# EAGLE design Sequencer-V01-010-eagle7 (EAGLE 7.7.0)
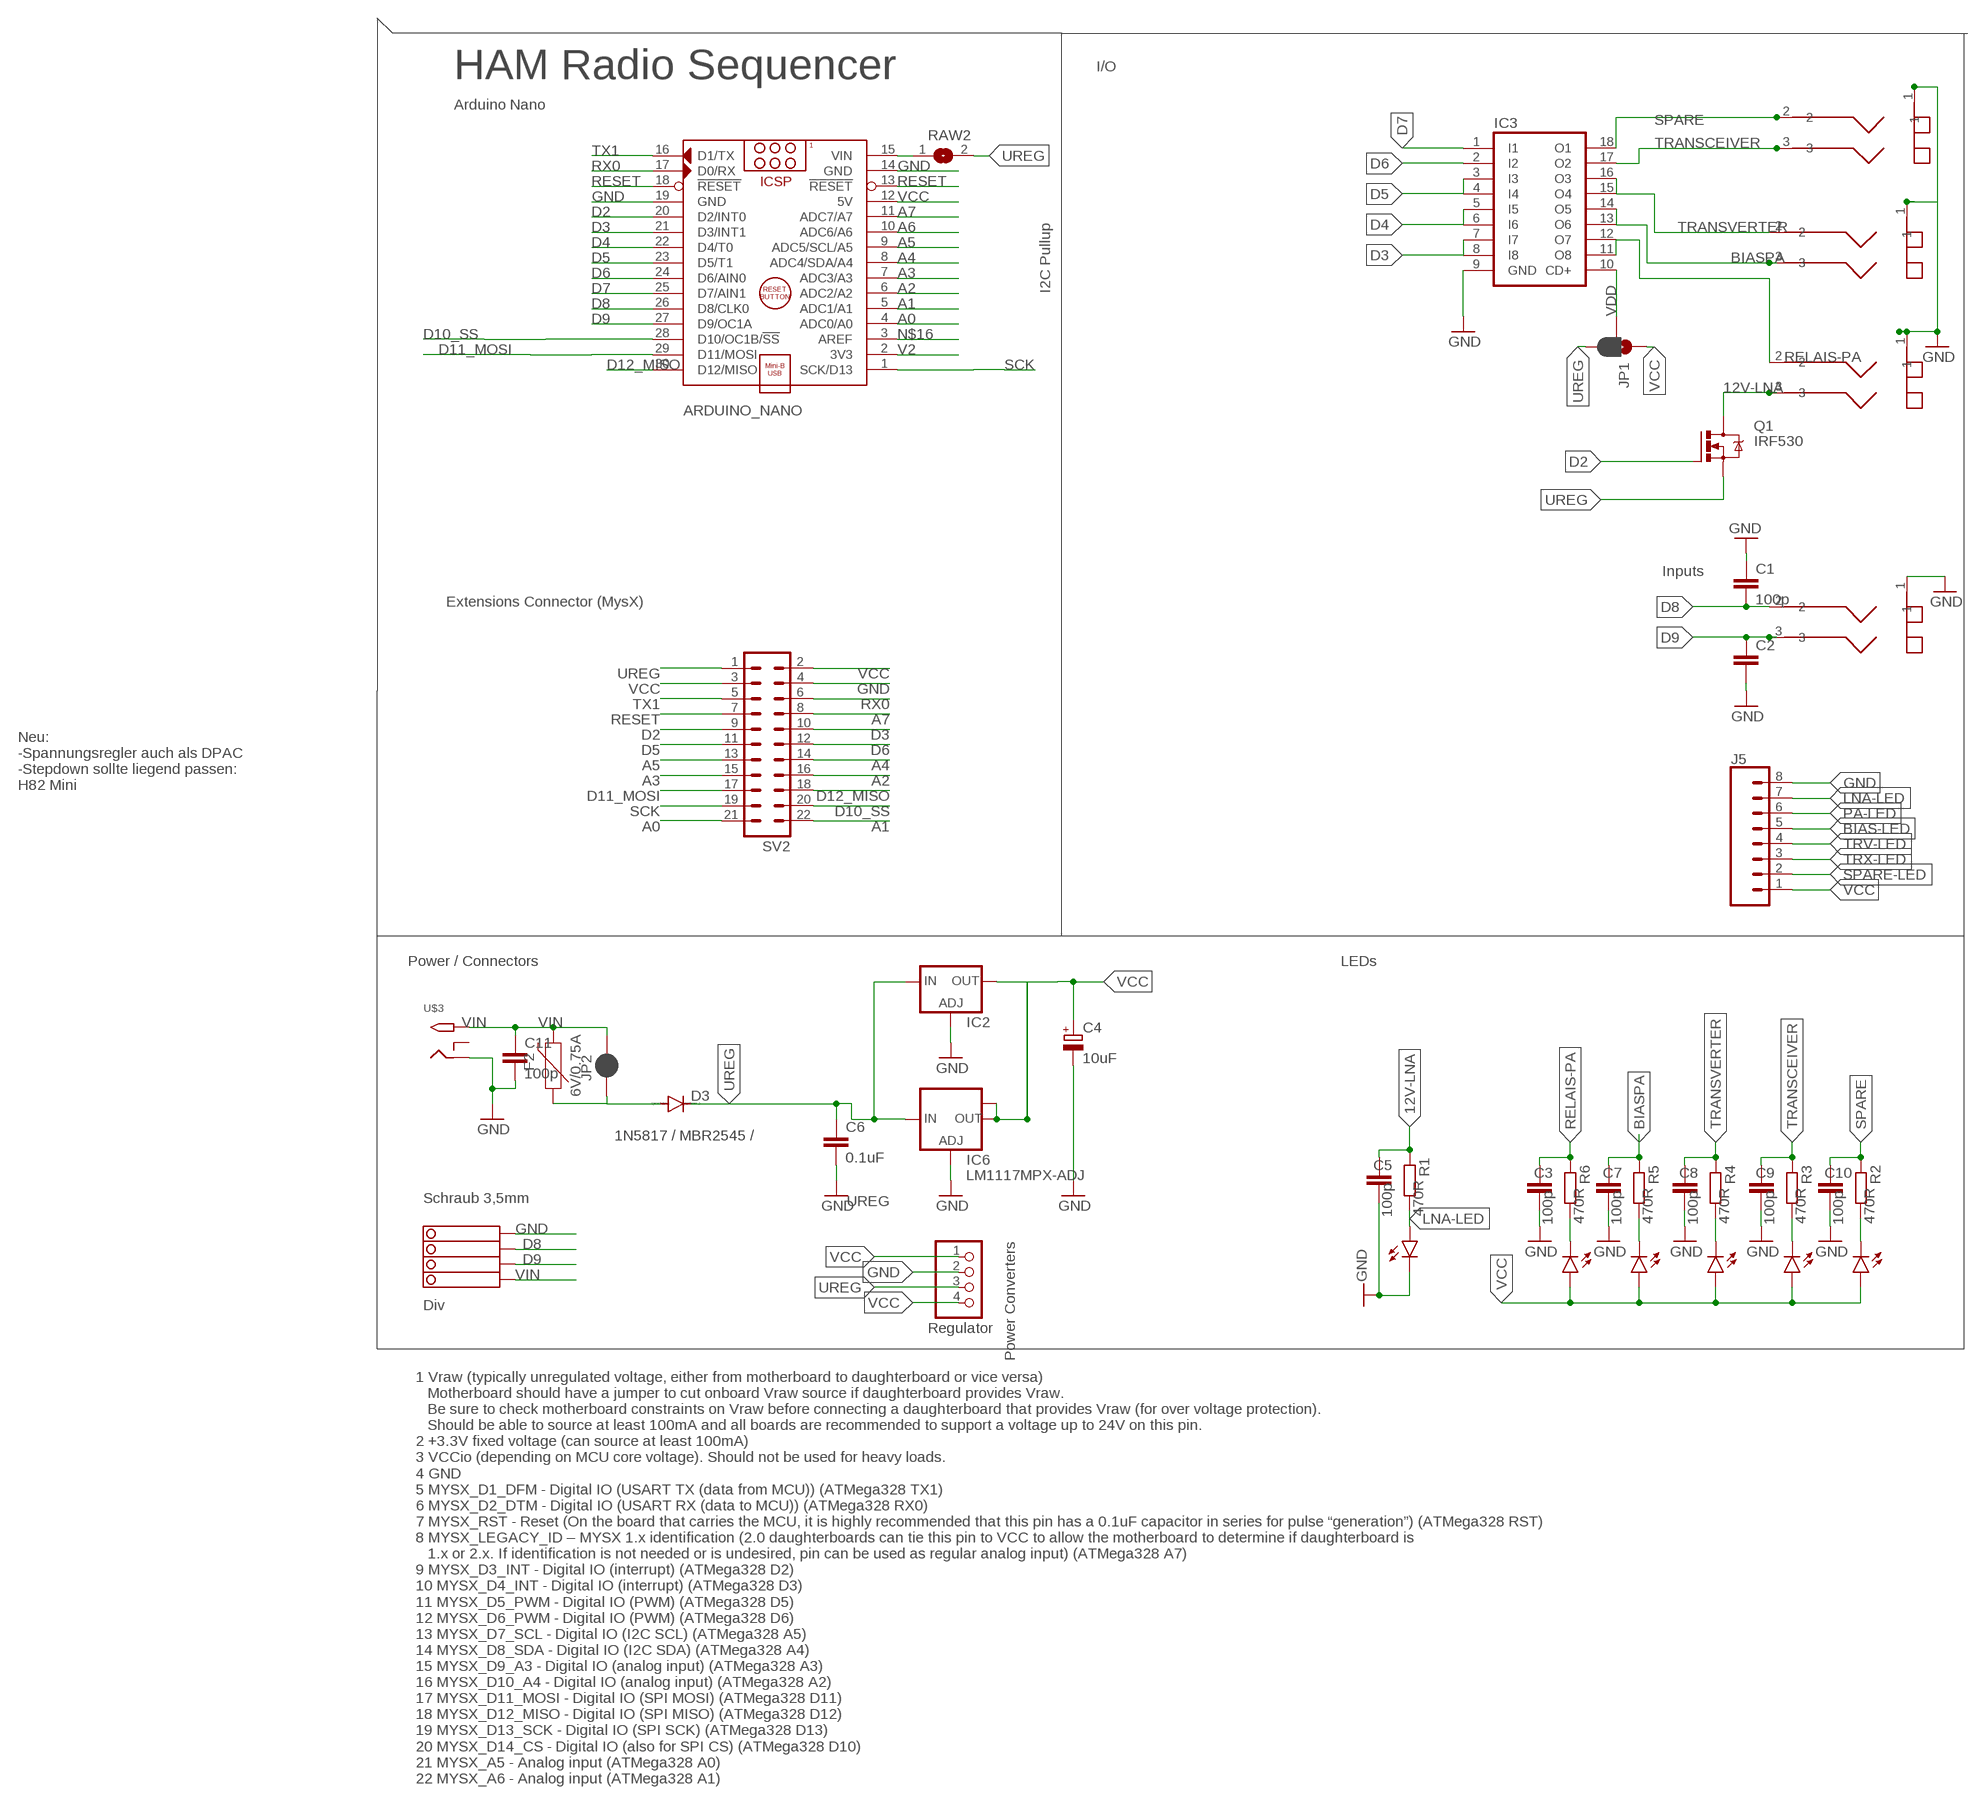
[diagram p0: schematic, sheet 1]

## Parts
ARDUINO_NANO  ARDUINO_NANO_OHNE-BOHR  [ARDUINO_NANO]
C1  100p  C-EU025-025X050  [C025-025X050]
C2  C-EU025-025X050  [C025-025X050]
C3  100p  C-EU025-025X050  [C025-025X050]
C4  10uF  CPOL-EUE3.5-8  [E3,5-8]
C5  100p  C-EU025-025X050  [C025-025X050]
C6  0.1uF  C-EU050-024X044  [C050-024X044]
C7  100p  C-EU025-025X050  [C025-025X050]
C8  100p  C-EU025-025X050  [C025-025X050]
C9  100p  C-EU025-025X050  [C025-025X050]
C10  100p  C-EU025-025X050  [C025-025X050]
C11  100p  C-EU025-025X050  [C025-025X050]
D3  1N5817 / MBR2545 /  DIODE-D-2.5  [D-2.5]
F2  6V/0.75A  PPTC_THREE-QUARTER-AMP  [1206]
IC2  LD117ADT50TR  [DPACK]
IC3  ULN2803A  [DIL18]
IC6  LM1117MPX-ADJ  [SOT223]
J1  RCJ-2234  [RCJ-2221]
J2  RCJ-2234  [RCJ-2221]
J3  RCJ-2234  [RCJ-2221]
J4  RCJ-2234  [RCJ-2221]
J5  CONN_08LOCK  [1X08_LOCK]
JP1  JUMPER-SMT_3_1-NC_PASTE_NO-SILK  [SMT-JUMPER_3_1-NC_PASTE_NO-SILK]
JP2  JUMPER-SMT_2_NC_PASTE_NO-SILK  [SMT-JUMPER_2_NC_PASTE_NO-SILK]
LED1  LED3MM  [LED3MM]
LED2  LED3MM  [LED3MM]
LED3  LED3MM  [LED3MM]
LED4  LED3MM  [LED3MM]
LED5  LED3MM  [LED3MM]
LED6  LED3MM  [LED3MM]
Q1  IRF530  [TO220BV]
R1  470R  R-EU_0204/5  [0204/5]
R2  470R  R-EU_0204/5  [0204/5]
R3  470R  R-EU_0204/5  [0204/5]
R4  470R  R-EU_0204/5  [0204/5]
R5  470R  R-EU_0204/5  [0204/5]
R6  470R  R-EU_0204/5  [0204/5]
RAW2  SJ  [SJ]
STEPDWN  PINHD-1X04_2.54-S  [1X04-S]
SV2  MA11-2  [MA11-2]
U$3  2.1MMJACKTHM  [PJ-102A]
X4  1751264  [1751264]

## Nets
12V-LNA: C5.1 J3.3 Q1.D R1.1
A0 [Signal]: ARDUINO_NANO.4(ADC0/A0) SV2.21
A1 [Signal]: ARDUINO_NANO.5(ADC1/A1) SV2.22
A2 [Signal]: ARDUINO_NANO.6(ADC2/A2) SV2.16
A3 [Signal]: ARDUINO_NANO.7(ADC3/A3) SV2.15
A4 [Signal]: ARDUINO_NANO.8(ADC4/SDA/A4) SV2.14
A5 [Signal]: ARDUINO_NANO.9(ADC5/SCL/A5) SV2.13
A6 [Signal]: ARDUINO_NANO.10(ADC6/A6)
A7 [Signal]: ARDUINO_NANO.11(ADC7/A7) SV2.8
BIAS-LED [Signal]: J5.5 LED5.K(C) R5.2
BIASPA: C7.1 IC3.13(O6) IC3.14(O5) J2.3 R5.1
D2 [Signal]: ARDUINO_NANO.20(D2/INT0) Q1.G SV2.9
D3 [Signal]: ARDUINO_NANO.21(D3/INT1) IC3.7(I7) IC3.8(I8) SV2.10
D4 [Signal]: ARDUINO_NANO.22(D4/T0) IC3.5(I5) IC3.6(I6)
D5 [Signal]: ARDUINO_NANO.23(D5/T1) IC3.3(I3) IC3.4(I4) SV2.11
D6 [Signal]: ARDUINO_NANO.24(D6/AIN0) IC3.2(I2) SV2.12
D7 [Signal]: ARDUINO_NANO.25(D7/AIN1) IC3.1(I1)
D8 [Signal]: ARDUINO_NANO.26(D8/CLK0) C1.2 J4.2 X4.3
D9 [Signal]: ARDUINO_NANO.27(D9/OC1A) C2.1 J4.3 X4.2
D10_SS [Signal]: ARDUINO_NANO.28(D10/OC1B/!SS) SV2.20
D11_MOSI [Signal]: ARDUINO_NANO.29(D11/MOSI) SV2.17
D12_MISO [Signal]: ARDUINO_NANO.30(D12/MISO) SV2.18
GND [Power]: ARDUINO_NANO.14(GND) ARDUINO_NANO.19(GND) C1.1 C2.2 C3.2 C4.- C5.2 C6.2 C7.2 C8.2 C9.2 C10.2 C11.2 IC2.1(ADJ) IC3.9(GND) IC6.1(ADJ) J1.1 J2.1 J3.1 J4.1 J5.8 LED1.K(C) STEPDWN.2 SV2.4 U$3.RING X4.4
LNA-LED [Signal]: J5.7 LED1.A R1.2
N$1: D3.A F2.1 JP2.1
N$16: ARDUINO_NANO.3(AREF)
PA-LED [Signal]: J5.6 LED6.K(C) R6.2
RAW1 [Power]: ARDUINO_NANO.15(VIN) RAW2.1
RELAIS-PA: C3.1 IC3.11(O8) IC3.12(O7) J3.2 R6.1
RESET [Signal]: ARDUINO_NANO.13(!RESET) ARDUINO_NANO.18(!RESET) SV2.7
RX0 [Signal]: ARDUINO_NANO.17(D0/RX) SV2.6
SCK [Signal]: ARDUINO_NANO.1(SCK/D13) SV2.19
SPARE: C10.1 IC3.18(O1) J1.2 R2.1
SPARE-LED [Signal]: J5.2 LED2.K(C) R2.2
TRANSCEIVER: C9.1 IC3.17(O2) J1.3 R3.1
TRANSVERTER: C8.1 IC3.15(O4) IC3.16(O3) J2.2 R4.1
TRV-LED [Signal]: J5.4 LED4.K(C) R4.2
TRX-LED [Signal]: J5.3 LED3.K(C) R3.2
TX1 [Signal]: ARDUINO_NANO.16(D1/TX) SV2.5
UREG [Power]: C6.1 D3.C IC2.3(IN) IC6.3(IN) JP1.3 Q1.S RAW2.2 STEPDWN.3 SV2.1
V2 [Power]: ARDUINO_NANO.2(3V3)
VCC [Power]: ARDUINO_NANO.12(5V) C4.+ IC2.4(OUT) IC6.2(OUT) IC6.TAB(OUT1) J5.1 JP1.1 LED2.A LED3.A LED4.A LED5.A LED6.A STEPDWN.1 STEPDWN.4 SV2.2 SV2.3
VDD: IC3.10(CD+) JP1.2
VIN [Power]: C11.1 F2.2 JP2.2 U$3.TIP X4.1
Unconnected: U$3.RING_SW

## Notes on the sheet
- I/O
- HAM Radio Sequencer
- Arduino Nano
- I2C Pullup
- Inputs
- Extensions Connector (MysX)
- Neu:
  -Spannungsregler auch als DPAC
  -Stepdown sollte liegend passen:  
  H82 Mini
- Power / Connectors | LEDs
- Schraub 3,5mm
- Power Converters
- Div
- Regulator
- 1 Vraw (typically unregulated voltage, either from motherboard to daughterboard or vice versa)
     Motherboard should have a jumper to cut onboard Vraw source if daughterboard provides Vraw. 
     Be sure to check motherboard constraints on Vraw before connecting a daughterboard that provides Vraw (for over voltage protection). 
     Should be able to source at least 100mA and all boards are recommended to support a voltage up to 24V on this pin.
  2 +3.3V fixed voltage (can source at least 100mA)
  3 VCCio (depending on MCU core voltage). Should not be used for heavy loads.
  4 GND
  5 MYSX_D1_DFM - Digital IO (USART TX (data from MCU)) (ATMega328 TX1)
  6 MYSX_D2_DTM - Digital IO (USART RX (data to MCU)) (ATMega328 RX0)
  7 MYSX_RST - Reset (On the board that carries the MCU, it is highly recommended that this pin has a 0.1uF capacitor in series for pulse “generation”) (ATMega328 RST)
  8 MYSX_LEGACY_ID – MYSX 1.x identification (2.0 daughterboards can tie this pin to VCC to allow the motherboard to determine if daughterboard is 
     1.x or 2.x. If identification is not needed or is undesired, pin can be used as regular analog input) (ATMega328 A7)
  9 MYSX_D3_INT - Digital IO (interrupt) (ATMega328 D2)
  10 MYSX_D4_INT - Digital IO (interrupt) (ATMega328 D3)
  11 MYSX_D5_PWM - Digital IO (PWM) (ATMega328 D5)
  12 MYSX_D6_PWM - Digital IO (PWM) (ATMega328 D6)
  13 MYSX_D7_SCL - Digital IO (I2C SCL) (ATMega328 A5)
  14 MYSX_D8_SDA - Digital IO (I2C SDA) (ATMega328 A4)
  15 MYSX_D9_A3 - Digital IO (analog input) (ATMega328 A3)
  16 MYSX_D10_A4 - Digital IO (analog input) (ATMega328 A2)
  17 MYSX_D11_MOSI - Digital IO (SPI MOSI) (ATMega328 D11)
  18 MYSX_D12_MISO - Digital IO (SPI MISO) (ATMega328 D12)
  19 MYSX_D13_SCK - Digital IO (SPI SCK) (ATMega328 D13)
  20 MYSX_D14_CS - Digital IO (also for SPI CS) (ATMega328 D10)
  21 MYSX_A5 - Analog input (ATMega328 A0)
  22 MYSX_A6 - Analog input (ATMega328 A1)

## Library data of the parts
ARDUINO_NANO = ArduinoNanoV30:ARDUINO_NANO_OHNE-BOHR: Arduino Nano V3.0 Module Overview: The Arduino Nano is a small, complete, and breadboard-friendly board based on the ATmega328 (Arduino Nano 3.x) or ATmega168 (Arduino Nano 2.x). It has more or less the same functionality of the Arduino Duemilanove, but in a different package. It lacks only a DC power jack, and works with a Mini-B USB cable instead of a standard one. The Nano was designed and is being produced by Gravitech <http://www.gravitech.us/arna30wiatp.html>. General specifications: Item Value Microcontroller Atmel ATmega168 or ATmega328 Operating Voltage (logic level) 5 V Input Voltage (recommended) 7-12 V Input Voltage (limits) 6-20 V Digital I/O Pins 14 (of which 6 provide PWM output) Analog Input Pins 8 DC Current per I/O Pin 40 mA Flash Memory 16 KB (ATmega168) or 32 KB (ATmega328) of which 2 KB used by bootloader SRAM 1 KB (ATmega168) or 2 KB (ATmega328) EEPROM 512 bytes (ATmega168) or 1 KB (ATmega328) Clock Speed 16 MHz Dimensions (Inches) 0.73" x 1.70" Dimensions (mm) 18mm x 45mm Overall height About 9 mm (not including pins) Weigth 5 g Power: The Arduino Nano can be powered via the Mini-B USB connection, 6-20V unregulated external power supply (pin 30), or 5V regulated external power supply (pin 27). The power source is automatically selected to the highest voltage source. Memory: The ATmega168 has 16 KB of flash memory for storing code (of which 2 KB is used for the bootloader); the ATmega328 has 32 KB, (also with 2 KB used for the bootloader). The ATmega168 has 1 KB of SRAM and 512 bytes of EEPROM (which can be read and written with the EEPROM library); the ATmega328 has 2 KB of SRAM and 1 KB of EEPROM. Input and Output: Each of the 14 digital pins on the Nano can be used as an input or output, using pinMode(), digitalWrite(), and digitalRead() functions. They operate at 5 volts. Each pin can provide or receive a maximum of 40 mA and has an internal pull-up resistor (disconnected by default) of 20-50 kOhms. In addition, some pins have specialized functions. Visit Arduino - ArduinoBoardNano <https://www.arduino.cc/en/Main/ArduinoBoardNano>
C1-C3 C5-C11 = rcl:C-EU: CAPACITOR, European symbol; SPICEPREFIX: C
C4 = rcl:CPOL-EU: POLARIZED CAPACITOR, European symbol; SPICEPREFIX: C
D3 = diode:DIODE-: DIODE
F2 = SparkFun-Fuses:PPTC: Resettable Fuse PPTC Resettable Fuse. Really a sort of resistor with a polymeric positive temperature coefficient whose resistance increases dramatically with an increase in temperature. When heated by the power passing through the resistance rises causing the current to be limited, protecting the circuit. This is achieved by the transition of the polymer from a crystalline to an amorphous state where the conductive carbon separates breaking the conductive pathways found in the cool crystalline structure. When a PPTC cools back down it resumes conducting letting the circuit turn back on. SparkFun Products: SparkFun RedBoard - Programmed with Arduino <https://www.sparkfun.com/products/12757> Pro Micro - 5V/16MHz <https://www.sparkfun.com/products/12640> Arduino Pro 328 - 5V/16MHz <https://www.sparkfun.com/products/10915> MP3 Trigger <https://www.sparkfun.com/products/13720>; PROD_ID: RES-11150
IC2 = v-reg:LD117A?*: Low drop fixed and adjustable positive voltage regulators 1 A Source: http://www.st.com/stonline/products/literature/ds/7194/ld1117axx.pdf
IC3 = uln-udn:ULN2803A: DRIVER ARRAY
IC6 = lm1117:LM1117MPX-ADJ
J1-J4 = RCA-RCJ-2234:RCJ-2234; AVAILABILITY: Unavailable; CUI_PURCHASE_URL: https://www.cuidevices.com/product/interconnect/connectors/rca-connectors/rcj-22-series?utm_source=snapeda.com&utm_medium=referral&utm_campaign=snapedaBOM; DESCRIPTION: 2-Port, Right-Angle, RCA Jack, Vertical; MF: CUI Devices; MP: RCJ-2234; PACKAGE: None; PRICE: None
J5 = SparkFun-Connectors:CONN_08: Multi connection point. Often used as Generic Header-pin footprint for 0.1 inch spaced/style header connections On any of the 0.1 inch spaced packages, you can populate with these: Break Away Headers - Straight <https://www.sparkfun.com/products/116> (PRT-00116) Break Away Male Headers - Right Angle <https://www.sparkfun.com/products/553> (PRT-00553) Female Headers <https://www.sparkfun.com/products/115> (PRT-00115) Break Away Headers - Machine Pin <https://www.sparkfun.com/products/117> (PRT-00117) Break Away Female Headers - Swiss Machine Pin <https://www.sparkfun.com/products/743> (PRT-00743) Arduino Stackable Header - 8 Pin <https://www.sparkfun.com/products/9279> (PRT-09279) For SCREWTERMINALS and SPRING TERMINALS visit here: Screw Terimnals on SparkFun.com <https://www.sparkfun.com/search/results?term=Screw+Terminals> (5mm/3.5mm/2.54mm spacing) This device is also useful as a general connection point to wire up your design to another part of your project. Our various solder wires solder well into these plated through hole pads. Hook-Up Wire - Assortment (Stranded, 22 AWG) <https://www.sparkfun.com/products/11375> (PRT-11375) Hook-Up Wire - Assortment (Solid Core, 22 AWG) <https://www.sparkfun.com/products/11367> (PRT-11367) View the entire wire category on our website here <https://www.sparkfun.com/categories/141> Special notes: Molex polarized connector foot print use with SKU : PRT-08231 with associated crimp pins and housings. 1MM SMD Version SKU: PRT-10208 NOTES ON THE VARIANTS LOCK and LOCK_LONGPADS... This footprint was designed to help hold the alignment of a through-hole component (i.e. 6-pin header) while soldering it into place. You may notice that each hole has been shifted either up or down by 0.005 of an inch from it's more standard position (which is a perfectly straight line). This slight alteration caused the pins (the squares in the middle) to touch the edges of the holes. Because they are alternating, it causes a "brace" to hold the component in place. 0.005 has proven to be the perfect amount of "off-center" position when using our standard breakaway headers. Although looks a little odd when you look at the bare footprint, once you have a header in there, the alteration is very hard to notice. Also,if you push a header all the way into place, it is covered up entirely on the bottom side.
JP1 = SparkFun-Jumpers:JUMPER-SMT_3_1-NC_PASTE: Normally closed solder jumper (1 of 2 connections) This jumper has an aperture in the stencil to allow solder paste to bridge one of the two connections. One connection is normally closed (NC), while the other is normally open (NO). Wick off the solder to open the connection. Reapply solder to reclose the connection. Apply solder to the other side instead to change the current path.
JP2 = SparkFun-Jumpers:JUMPER-SMT_2_NC_PASTE: Normally closed solder jumper This jumper has an aperture in the stencil to allow solder paste to bridge the split in the wire so it's normally closed (NC). Wick off the solder to open the connection. Reapply solder to reclose the connection.
LED1-LED6 = led:LED: LED OSRAM: - CHIPLED LG R971, LG N971, LY N971, LG Q971, LY Q971, LO R971, LY R971 LH N974, LH R974 LS Q976, LO Q976, LY Q976 LO Q996 - Hyper CHIPLED LW Q18S LB Q993, LB Q99A, LB R99A - SideLED LS A670, LO A670, LY A670, LG A670, LP A670 LB A673, LV A673, LT A673, LW A673 LH A674 LY A675 LS A676, LA A676, LO A676, LY A676, LW A676 LS A679, LY A679, LG A679 - Hyper Micro SIDELED® LS Y876, LA Y876, LO Y876, LY Y876 LT Y87S - SmartLED LW L88C, LW L88S LB L89C, LB L89S, LG L890 LS L89K, LO L89K, LY L89K LS L896, LA L896, LO L896, LY L896 - TOPLED LS T670, LO T670, LY T670, LG T670, LP T670 LSG T670, LSP T670, LSY T670, LOP T670, LYG T670 LG T671, LOG T671, LSG T671 LB T673, LV T673, LT T673, LW T673 LH T674 LS T676, LA T676, LO T676, LY T676, LB T676, LH T676, LSB T676, LW T676 LB T67C, LV T67C, LT T67C, LS T67K, LO T67K, LY T67K, LW E67C LS E67B, LA E67B, LO E67B, LY E67B, LB E67C, LV E67C, LT E67C LW T67C LS T679, LY T679, LG T679 LS T770, LO T770, LY T770, LG T770, LP T770 LB T773, LV T773, LT T773, LW T773 LH T774 LS E675, LA E675, LY E675, LS T675 LS T776, LA T776, LO T776, LY T776, LB T776 LHGB T686 LT T68C, LB T68C - Hyper Mini TOPLED® LB M676 - Mini TOPLED Santana® LG M470 LS M47K, LO M47K, LY M47K Source: http://www.osram.convergy.de LUXEON: - LUMILED® LXK2-PW12-R00, LXK2-PW12-S00, LXK2-PW14-U00, LXK2-PW14-V00 LXK2-PM12-R00, LXK2-PM12-S00, LXK2-PM14-U00 LXK2-PE12-Q00, LXK2-PE12-R00, LXK2-PE12-S00, LXK2-PE14-T00, LXK2-PE14-U00 LXK2-PB12-K00, LXK2-PB12-L00, LXK2-PB12-M00, LXK2-PB14-N00, LXK2-PB14-P00, LXK2-PB14-Q00 LXK2-PR12-L00, LXK2-PR12-M00, LXK2-PR14-Q00, LXK2-PR14-R00 LXK2-PD12-Q00, LXK2-PD12-R00, LXK2-PD12-S00 LXK2-PH12-R00, LXK2-PH12-S00 LXK2-PL12-P00, LXK2-PL12-Q00, LXK2-PL12-R00 Source: www.luxeon.com KINGBRIGHT: KA-3528ASYC Source: www.kingbright.com
Q1 = transistor-power:IRF530: HEXFET Power MOSFET
R1-R6 = rcl:R-EU_: RESISTOR, European symbol; SPICEPREFIX: R
RAW2 = jumper:SJ: SMD solder JUMPER
STEPDWN = pinhead-2:PINHD-1X04: PIN HEADER
SV2 = con-Pinheader:MA11-2: PIN HEADER; OC_FARNELL: unknown; OC_NEWARK: unknown
U$3 = adafruit:2.1MMJACK: 2.1mm x 5.5mm THM DC jack with internal switch. Digikey part #PJ-102A, 4UCON part #05537 2.1mm x 5.5mm SMT DC jack with internal switch. Digikey part #PJ-002A-SMT, 4UCON part #03267 By microbuilder.eu & adafruit.com
X4 = con-phoenix-350:1751264: MKDS 1/ 4-3,5 Printklemme Nennstrom: 10 A Bemessungsspannung: 160 V Raster: 3,5 mm Polzahl: 4 Montageart: Löten Anschlussart: Schraubanschluss Anschlussrichtung vom Leiter zur Platine: 0° Source: http://eshop.phoenixcontact.com .. 1751264.pdf; MPN: 1751264; OC_FARNELL: unknown; OC_NEWARK: 10R0934

## Net classes
0 default: width 1.219 mm
1 Power: width 0.762 mm
2 Signal: width 0.305 mm

## Board
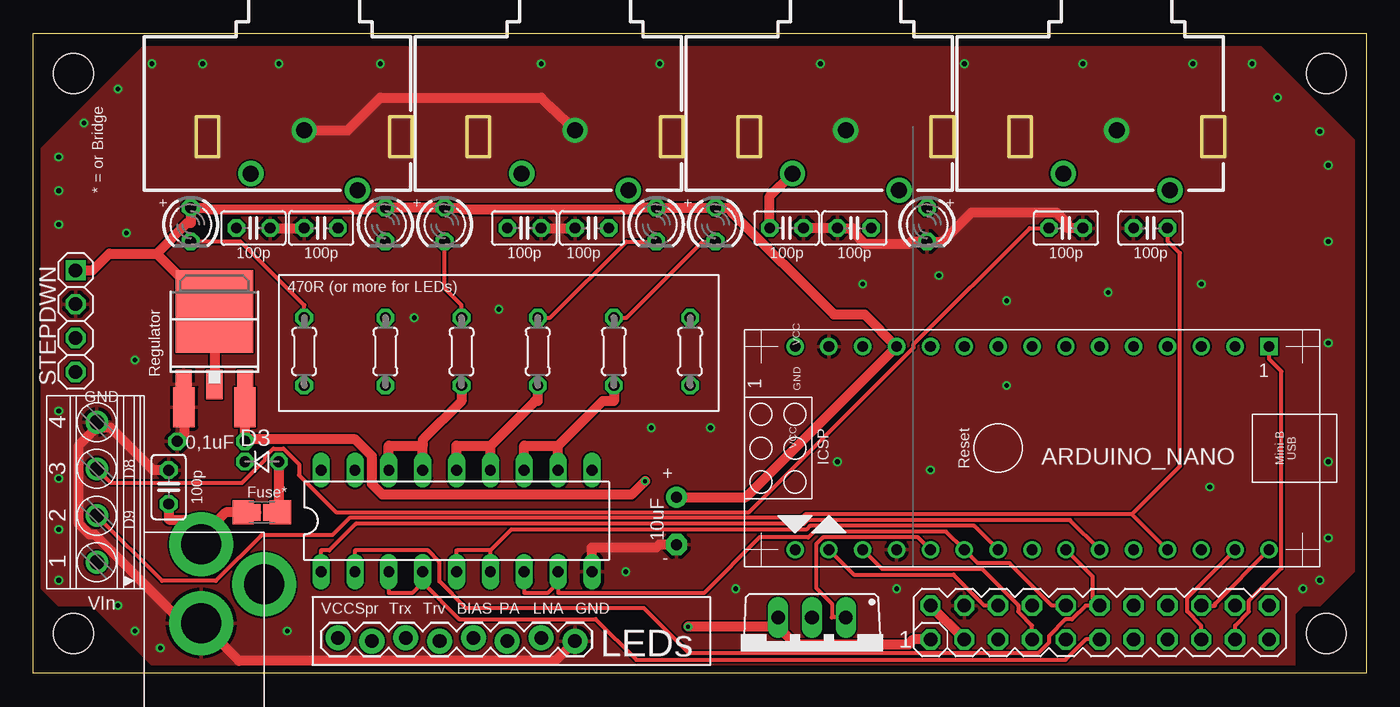
[diagram p1: board, top side]
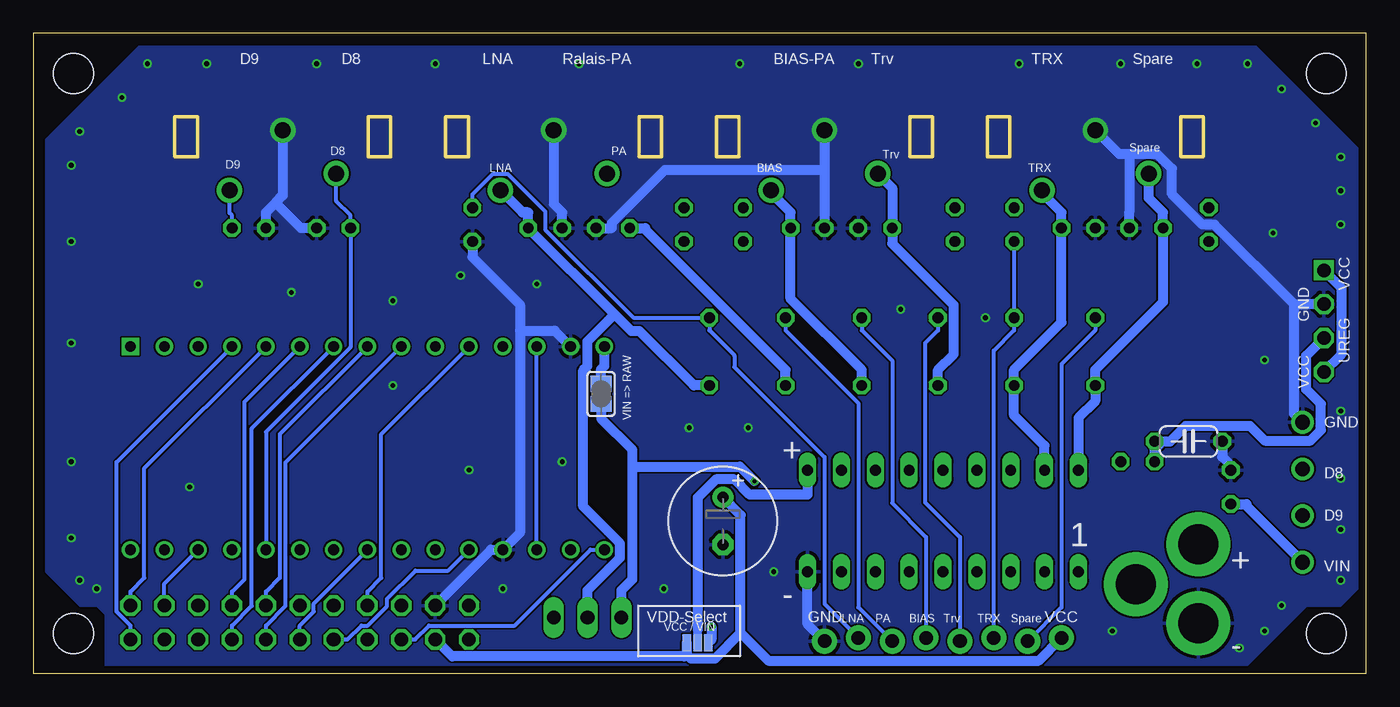
[diagram p2: board, bottom side, seen from below]

Size 100 x 48 mm. Coordinates in mm from the lower left corner, seen from the top.
Outline: 100,0 0,0 0,48 100,48 100,0
Copper layers (1*16): Top 0.035mm / dielectric 1.5mm / Bottom 0.035mm
Design rules "dirt_cheap_dirty_boards.v1": minimum track width 5mil, minimum drill 12mil, track to track 5mil, track to pad 5mil, pad to pad 5mil, via to via 5mil, smd to smd 0mil, copper to edge 10mil, drill to drill 10mil, minimum pad ring 10mil, minimum via ring 6mil, stop-mask expansion 2mil, vias tented up to drill 25mil, thermal gap 10mil
Holes 3 mm at 3,45 97,45 97,3 3,3

### Footprints (pad centres in the part's own frame; a part is rotated, then mirrored left to right if it is on the bottom)
ARDUINO_NANO = drill 0.8 square: 1 -20.32,-7.62 | drill 0.8: 2 -17.78,-7.62; 3 -15.24,-7.62; 4 -12.7,-7.62; 5 -10.16,-7.62; 6 -7.62,-7.62; 7 -5.08,-7.62; 8 -2.54,-7.62; 9 0,-7.62; 10 2.54,-7.62; 11 5.08,-7.62; 12 7.62,-7.62; 13 10.16,-7.62; 14 12.7,-7.62; 15 15.24,-7.62; 16 15.24,7.62; 17 12.7,7.62; 18 10.16,7.62; 19 7.62,7.62; 20 5.08,7.62; 21 2.54,7.62; 22 0,7.62; 23 -2.54,7.62; 24 -5.08,7.62; 25 -7.62,7.62; 26 -10.16,7.62; 27 -12.7,7.62; 28 -15.24,7.62; 29 -17.78,7.62; 30 -20.32,7.62
C025-025X050 = drill 0.813 octagon: 1 -1.27,0; 2 1.27,0
E3,5-8 = drill 0.813 pad 1.6: + -1.778,0 | drill 0.813 pad 1.6 octagon: - 1.778,0
C050-024X044 = drill 0.813 octagon: 1 -2.54,0; 2 2.54,0
D-2.5 = drill 0.813 octagon: A 1.27,0; C -1.27,0
1206 = smd 1.6 x 1.8: 1 -1.4,0; 2 1.4,0
DPACK = smd 1.6 x 3: 1 -2.28,-4.8; 3 2.28,-4.8 | smd 5.8 x 6.2: 4 0,2.38
DIL18 = drill 0.813 long: 1 -10.16,-3.81; 2 -7.62,-3.81; 3 -5.08,-3.81; 4 -2.54,-3.81; 5 0,-3.81; 6 2.54,-3.81; 7 5.08,-3.81; 8 7.62,-3.81; 9 10.16,-3.81; 10 10.16,3.81; 11 7.62,3.81; 12 5.08,3.81; 13 2.54,3.81; 14 0,3.81; 15 -2.54,3.81; 16 -5.08,3.81; 17 -7.62,3.81; 18 -10.16,3.81
SOT223 = smd 1.219 x 2.235: 1 -2.311,-3.099; 2 0,-3.099; 3 2.311,-3.099 | smd 3.6 x 2.2: TAB 0,3.099
RCJ-2221 = drill 1.2 pad 1.9: 1 -2.25,0; 2 1,-4; 3 2.25,4
1X08_LOCK = drill 1.016 pad 1.88: 1 0,0.127; 2 2.54,-0.127; 3 5.08,0.127; 4 7.62,-0.127; 5 10.16,0.127; 6 12.7,-0.127; 7 15.24,0.127; 8 17.78,-0.127
SMT-JUMPER_3_1-NC_PASTE_NO-SILK = smd 0.635 x 1.27: 1 -0.813,0; 2 0,0; 3 0.813,0
SMT-JUMPER_2_NC_PASTE_NO-SILK = smd 0.635 x 1.27: 1 -0.406,0; 2 0.406,0
LED3MM = drill 0.813 octagon: A -1.27,0; K 1.27,0
TO220BV = drill 1.016 long: D 0,-2.54; G -2.54,-2.54; S 2.54,-2.54
0204/5 = drill 0.813 octagon: 1 -2.54,0; 2 2.54,0
SJ = smd 1.168 x 1.6: 1 -0.762,0; 2 0.762,0
1X04-S = drill 1.016 square: 1 -3.81,0 | drill 1.016 octagon: 2 -1.27,0; 3 1.27,0; 4 3.81,0
MA11-2 = drill 1.016 octagon: 1 -12.7,-1.27; 2 -12.7,1.27; 3 -10.16,-1.27; 4 -10.16,1.27; 5 -7.62,-1.27; 6 -7.62,1.27; 7 -5.08,-1.27; 8 -5.08,1.27; 9 -2.54,-1.27; 10 -2.54,1.27; 11 0,-1.27; 12 0,1.27; 13 2.54,-1.27; 14 2.54,1.27; 15 5.08,-1.27; 16 5.08,1.27; 17 7.62,-1.27; 18 7.62,1.27; 19 10.16,-1.27; 20 10.16,1.27; 21 12.7,-1.27; 22 12.7,1.27
PJ-102A = drill 3 pad 4.8: RING 0.1,-3.39; RING_SW -4.6,-6.29; TIP 0.1,-9.29
1751264 = drill 1.1 pad 1.7: 1 -5.25,-0.1; 2 -1.75,-0.1; 3 1.75,-0.1; 4 5.25,-0.1

### Placement (x,y rotation side)
ARDUINO_NANO  72.39,16.89 180 top
C1  77.47,33.4 180 top
C2  83.82,33.4 180 top
C3  56.52,33.4 0 top
C4  48.26,11.43 270 bottom
C5  61.59,33.4 180 top
C6  13.34,17.4 0 bottom
C7  41.91,33.4 180 top
C8  36.83,33.4 0 top
C9  21.59,33.4 180 top
C10  16.51,33.4 0 top
C11  10.16,13.97 90 top
D3  17.14,15.88 0 top
F2  17.14,12.06 180 top
IC2  13.59,24.77 0 top
IC3  31.75,11.43 0 top
IC6  13.59,24.77 0 top
J1  20.32,38.48 270 top
J2  40.64,38.48 270 top
J3  60.96,38.48 270 top
J4  81.28,38.48 270 top
J5  22.86,2.54 0 top
JP1  50.16,2.29 0 bottom
JP2  17.14,12.06 180 top
LED1  67.06,33.66 270 top
LED2  11.81,33.66 270 top
LED3  26.41,33.66 270 top
LED4  30.86,33.66 270 top
LED5  46.73,33.66 270 top
LED6  51.18,33.66 270 top
Q1  58.42,1.65 180 top
R1  49.27,24.13 90 top
R2  20.32,24.13 90 top
R3  26.41,24.13 90 top
R4  32.13,24.13 90 top
R5  37.84,24.13 90 top
R6  43.56,24.13 90 top
RAW2  57.41,20.95 270 bottom
STEPDWN  3.17,26.41 270 top
SV2  80.01,3.81 0 top
U$3  12.7,0.38 180 top
X4  4.67,13.59 90 top

### Tracks (layer width: path | path; a pad name or v marks a point on that pad's centre or on a via)
12V-LNA
  Bottom 0.762: Q1.D 58.42,6.22 55.99,8.65 55.99,9.75 58.75,12.52 58.75,22.72 58.44,23.03 58.44,24.89 56.4,26.93 | 56.4,26.93 C5.1 62.87,34.57 63.3,34.57 J3.3 | 56.4,26.93 55.14,25.67 54.53,25.67 50.44,21.59 R1.1
A0
  Bottom 0.305: SV2.21 92.71,3.58 93.75,4.62 93.75,15.85 ARDUINO_NANO.4
A1
  Bottom 0.305: SV2.22 92.71,6.12 91.67,7.16 91.67,15.39 ARDUINO_NANO.5
A2
  Bottom 0.305: SV2.16 85.09,6.12 84.16,7.05 84.16,20.36 ARDUINO_NANO.6
A3
  Bottom 0.305: SV2.15 85.09,3.58 83.62,5.05 83.62,18.36 ARDUINO_NANO.7
A4
  Bottom 0.305: ARDUINO_NANO.8 81.51,17.93 81.51,7.16 82.55,6.12 SV2.14
A5
  Bottom 0.305: SV2.13 82.55,3.58 81.08,5.05 81.08,15.82 ARDUINO_NANO.9
A7
  Bottom 0.305: SV2.8 74.93,6.12 73.89,7.16 73.89,17.93 ARDUINO_NANO.11
BIAS-LED
  Top 0.305: R5.2 38.78,26.67 44.5,32.38 LED5.K
  Bottom 0.305: R5.2 37.84,25.73 35.56,23.45 35.56,12.76 33.02,10.22 J5.5
BIASPA
  Top 0.762: R5.1 37.84,20.42 37.64,20.42 34.29,17.07 | IC3.13 34.29,17.07 | IC3.14 31.75,17.07 34.29,17.07
  Bottom 0.762: J2.3 44.64,36.03 43.18,34.57 C7.1 43.18,28.09 37.84,22.76 R5.1
D2
  Top 0.305: Q1.G 59.92,4.19 59.92,5.23 58.73,6.42 58.73,9.69 59.25,10.2 66.38,10.2 ARDUINO_NANO.20
  Bottom 0.305: SV2.9 76.43,2.54 75.39,3.58 74.91,3.58 73.46,5.04 73.46,5.58 71.34,7.7 68.88,7.7 ARDUINO_NANO.20
D3
  Top 0.305: SV2.10 76.43,5.08 73.25,8.26 70.86,8.26 ARDUINO_NANO.21 68.48,10.64 58.58,10.64 58.15,10.2 54.48,10.2 50.3,6.02 39.37,6.02 39.37,6.82 | IC3.7 36.83,6.02 38.57,6.02 39.37,6.82 | IC3.8 39.37,6.82
D4
  Top 0.305: ARDUINO_NANO.22 70.59,11.07 58.28,11.07 58,10.79 35.86,10.79 34.29,9.22 | 34.29,9.22 34.29,9.11 IC3.6 | IC3.5 31.75,9.22 34.29,9.22
D5
  Top 0.305: 29.21,6.82 31.96,4.07 42.19,4.07 45.24,1.01 77.44,1.01 78.97,2.54 SV2.11 | 29.21,6.82 28.41,6.02 26.67,6.02 IC3.3 | IC3.4 29.21,6.82
  Bottom 0.305: SV2.11 80.01,3.58 78.97,4.62 78.97,5.23 ARDUINO_NANO.23
D6
  Top 0.305: 79.49,5.08 79.49,7.25 ARDUINO_NANO.24 | 79.49,5.08 78.97,5.08 77.93,4.04 77.44,4.04 76.2,2.79 76.2,2.31 75.39,1.5 49.21,1.5 45.81,4.89 32.48,4.89 30.48,6.9 30.48,8.35 29.61,9.22 24.13,9.22 IC3.2 | SV2.12 79.49,5.08
D7
  Top 0.305: ARDUINO_NANO.25 77.78,11.5 58.1,11.5 57.82,11.22 24.2,11.22 22.2,9.22 21.59,9.22 IC3.1
D8
  Top 0.305: X4.3 5.82,14.29 15.66,14.29 17.39,16.02 17.39,16.24 18.01,16.86 18.77,16.86 19.93,15.7 19.93,14.86 22.71,12.08 53.7,12.08 66.04,24.42 66.04,24.68 74.76,33.4 C1.2
  Bottom 0.305: ARDUINO_NANO.26 82.55,18.11 76.2,24.46 C1.2 76.2,34.34 77.28,35.42 J4.2
D9
  Top 0.305: 82.43,11.93 57.92,11.93 57.64,11.65 23.71,11.65 22.44,10.37 17.12,10.37 13.7,6.94 9.66,6.94 X4.2 | ARDUINO_NANO.27 82.43,11.93 | 82.43,11.93 86.03,15.53 86.03,31.52 85.09,32.46 C2.1
  Bottom 0.305: C2.1 85.09,34.34 85.28,34.53 J4.3
D10_SS
  Bottom 0.305: SV2.20 90.17,6.73 ARDUINO_NANO.28
D11_MOSI
  Top 0.305: SV2.17 87.63,3.58 86.57,4.64 86.57,5.67 ARDUINO_NANO.29
D12_MISO
  Top 0.305: SV2.18 88.67,5.08 88.67,5.23 ARDUINO_NANO.30
GND  (via drill 0.35)
  Top 0.762: C4.- 46.95,9.65 46.75,9.45 41.91,9.45 IC3.9 | 4.77,18.45 5.78,18.45 8.99,15.24 C11.2 | 4.77,18.45 3.41,17.09 3.41,11.22 4.23,10.4 4.63,10.4 11.26,3.77 U$3.RING 15.43,0.94 39.16,0.94 J5.8 | 4.77,18.45 X4.4 | C3.2 C5.2 61.49,33.4 61.49,33.11 62.37,32.23 65.73,32.23 65.89,32.38 LED1.K 68.22,32.38 70.41,34.57 76.76,34.57 77.57,33.76 77.57,33.4 C1.1 | C6.2 10.79,17.44 11.31,17.96 IC2.1 11.31,20.01 11.28,20.04 IC6.1 | J1.1 23.59,40.73 26.04,43.18 38.1,43.18 38.73,42.55 J2.1 | C8.2 C7.2 | C10.2 C9.2
  Bottom 0.762: 63.5,25.71 63.5,10.54 ARDUINO_NANO.19 65.66,9.27 SV2.4 | 63.5,25.71 63.5,27.66 67.06,31.22 LED1.K | 63.5,25.71 60.89,25.71 ARDUINO_NANO.14 | 17.78,38.95 18.54,38.95 J1.1 | 5.4,27.67 11.39,33.66 12.28,33.66 14.57,35.94 14.57,37.85 15.67,38.95 17.78,38.95 | 17.78,38.95 17.78,34.57 C10.2 | X4.4 5.4,19.46 5.4,27.67 | 5.4,27.67 4.46,27.67 4.45,27.68 STEPDWN.2 | C6.2 10.79,16.23 10.16,15.6 C11.2 | 40.64,37.74 C7.2 | J2.1 40.64,37.74 | 40.64,37.74 52.64,37.74 56.62,33.76 56.62,33.4 C3.2 | 81.81,35.3 82.55,34.57 C2.2 | J4.1 81.28,35.84 81.81,35.3 | 81.81,35.3 79.91,33.4 C1.1 | J5.8 41.91,3.68 IC3.9 | C5.2 60.33,34.57 60.96,35.2 J3.1
  other vias: 1.91,33.66 1.91,36.2 1.91,38.73 3.81,41.27 6.35,43.81 8.89,45.72 12.7,45.72 18.41,45.72 26.04,45.72 38.1,45.72 46.99,45.72 59.05,45.72 69.85,45.72 78.74,45.72 87,45.72 91.44,45.72 93.34,43.18 96.52,40.64 97.16,38.1 97.16,32.38 97.16,24.77 97.16,15.88 97.16,10.16 96.52,6.99 95.25,6.35 88.27,13.97 87.63,29.21 80.64,28.57 73.03,27.94 67.94,29.84 62.23,29.21 60.33,15.88 50.8,18.41 46.35,18.41 34.92,27.3 28.57,26.67 19.05,3.17 44.45,7.62 64.77,6.35 73.03,21.59 67.31,15.24 9.53,1.91 7.62,3.17 6.35,5.08 1.91,6.99 1.91,10.79 1.91,14.61 1.91,19.68 7.62,23.5 6.99,33.02 52.7,6.35
  pour Top: 0.64,6.35 0.64,39.37 8.26,46.99 92.08,46.99 99.06,40.01 99.06,7.62 97.79,6.35 96.52,5.08 95.25,5.08 94.61,4.45 94.61,0.64 8.89,0.64 4.45,5.08 1.91,5.08
  pour Bottom: 8.89,0.64 4.45,5.08 1.91,5.08 0.64,6.35 0.64,39.37 8.26,46.99 92.08,46.99 99.06,40.01 99.06,7.62 96.52,5.08 95.25,5.08 94.61,4.45 94.61,0.64
LNA-LED
  Bottom 0.305: J5.7 40.64,5.21 40.64,16.21 47.4,22.96 47.4,23.85 49.27,25.73 R1.2 54.98,26.67 61.59,33.28 61.59,34.65 64.41,37.46 65.5,37.46 67.06,35.91 LED1.A
N$1
  Top 0.635: 17.8,12.06 JP2.1
  Top 0.762: 18.41,12.06 F2.1 | 18.41,12.06 18.41,14.71 D3.A | 17.8,12.06 18.41,12.06
PA-LED
  Top 0.305: R6.2 44.5,26.67 50.22,32.38 LED6.K
  Bottom 0.305: R6.2 43.56,25.73 38.1,20.27 38.1,4.95 J5.6
RAW1
  Bottom 0.762: RAW2.1 57.41,22.81 57.15,23.06 ARDUINO_NANO.15
RELAIS-PA
  Top 0.762: C3.1 55.24,35.77 J3.2 | R6.1 43.56,20.42 42.72,20.42 39.37,17.07 | IC3.11 39.37,17.07 | IC3.12 36.83,17.07 39.37,17.07
  Bottom 0.762: C3.1 54.08,33.4 54.08,33.27 43.56,22.76 R6.1
RESET
  Top 0.305: ARDUINO_NANO.18 63.67,7.83 71.16,7.83 73.89,5.1 73.89,4.62 74.93,3.58 SV2.7
  Bottom 0.305: ARDUINO_NANO.18 ARDUINO_NANO.13
RX0
  Top 0.305: ARDUINO_NANO.17 61.56,7.4 69.03,7.4 71.35,5.08 SV2.6
SCK
  Top 0.305: ARDUINO_NANO.1 92.71,23.58 93.64,22.64 93.64,7.88 91.21,5.44 91.21,4.62 90.17,3.58 SV2.19
SPARE
  Bottom 0.762: J1.2 16.32,35.65 15.24,34.57 C10.1 15.24,27.84 20.32,22.76 R2.1 20.32,20.42 21.59,19.15 IC3.18
SPARE-LED
  Top 0.305: R2.2 20.32,27.61 15.54,32.38 LED2.K
  Bottom 0.305: R2.2 20.32,25.73 22.86,23.19 22.86,4.95 J5.2
TRANSCEIVER
  Bottom 0.762: J1.3 24.32,36.03 22.86,34.57 C9.1 22.86,26.31 26.41,22.76 R3.1 26.41,19.35 24.13,17.07 IC3.17
TRANSVERTER
  Top 0.762: R4.1 32.13,20.42 29.21,17.5 29.21,17.07 | IC3.15 29.21,17.07 | IC3.16 26.67,17.07 29.21,17.07
  Bottom 0.762: R4.1 32.13,22.76 30.95,23.94 30.95,27.62 35.56,32.23 C8.1 35.56,36.4 J2.2
TRV-LED
  Top 0.305: R4.2 32.13,27.61 30.86,28.88 LED4.K
  Bottom 0.305: R4.2 32.13,25.73 33.09,24.77 33.09,12.83 30.48,10.22 J5.4
TRX-LED
  Bottom 0.305: J5.3 27.94,24.2 26.41,25.73 R3.2 LED3.K
TX1
  Bottom 0.305: SV2.5 71.35,2.54 70.31,3.58 63.89,3.58 58.2,9.27 ARDUINO_NANO.16
UREG  (via drill 0.3 pad 0.61)
  Top 0.762: 55.88,3.51 Q1.S | 55.88,3.51 57.23,2.16 65.66,2.16 66.04,2.54 SV2.1 | 55.88,3.51 v49.13,3.51 | 15.88,17.54 C6.1 | 15.88,17.54 15.88,17.95 15.87,17.96 IC2.3 15.9,20 IC6.3 | v45.9,14.42 44.87,13.39 26.2,13.39 25.4,14.19 25.4,16.29 24.15,17.54 15.88,17.54
  Bottom 0.635: 49.13,2.51 JP1.3
  Bottom 0.762: v49.13,3.51 v49.13,3.5 49.13,2.51 | 55.05,15.51 55.05,16.75 57.41,19.1 RAW2.2 | 55.05,15.51 55.05,7.05 55.88,6.22 Q1.S | 55.05,15.51 46.99,15.51 v45.9,14.42 | D3.C 15.88,17.04 15.65,17.04 15.29,17.4 | 15.29,17.4 14.71,17.4 13.54,18.57 8.73,18.57 7.62,17.46 4.18,17.46 3.4,18.24 3.4,20.21 4.5,21.3 4.5,23.82 STEPDWN.3 | C6.1 15.29,17.4
VCC
  Top 0.762: 9.25,31.49 12.87,27.86 | 9.25,31.49 5.71,31.49 4.45,30.23 STEPDWN.1 | 9.25,31.49 11.52,33.76 11.81,33.76 LED2.A 12.98,34.92 13.13,34.77 25.09,34.77 25.25,34.92 LED3.A LED4.A 32.03,34.92 32.18,34.77 45.41,34.77 45.57,34.92 LED5.A LED6.A 52.35,34.92 52.35,34.63 60.06,26.92 62.36,26.92 ARDUINO_NANO.12 53.47,13.21 C4.+ | IC6.2 IC2.4 12.87,27.86 | IC6.TAB 12.87,27.86 | SV2.3 SV2.2
  Bottom 0.635: 50.99,2.27 JP1.1
  Bottom 0.762: 46.92,3.03 46.92,11.87 C4.+ | 50.99,1.44 50.67,1.12 48.83,1.12 46.92,3.03 | 46.92,3.03 44.85,0.96 24.57,0.96 J5.1 | 50.99,1.44 51.16,1.27 68.58,1.27 SV2.3 | 50.99,2.27 50.99,1.44 | STEPDWN.4 1.85,23.93 1.85,28.9 STEPDWN.1
VDD
  Bottom 0.635: 50.16,3.28 JP1.2
  Bottom 0.762: IC3.10 41.91,13.41 46.27,13.41 47.41,14.55 48.78,14.55 50.16,13.17 50.16,3.28
VIN
  Top 0.635: 16.73,12.06 JP2.2
  Top 0.762: 12.6,10.94 13.31,10.94 14.44,12.06 F2.2 16.73,12.06 | 12.6,10.94 12.01,11.53 10.16,11.53 C11.1 | 12.6,10.94 U$3.TIP
  Bottom 0.762: C11.1 8.99,12.7 8.99,12.56 X4.1

### Text on the board
tPlace: VCC | GND | VCC
tNames: * = or Bridge | + | + | + | + | 100p | 100p | 100p | 100p | 100p | 100p | 100p | 100p | 470R (or more for LEDs) | Regulator | GND | 0,1uF | D8 | + | Fuse* | 100p | 10uF | D9 | - | VIn | VCC | Spr | Trx | Trv | BIAS | PA | LNA | GND | LEDs
bNames: Spare | TRX | Trv | BIAS-PA | Ralais-PA | LNA | D8 | D9 | Spare | Trv | PA | D8 | TRX | BIAS | LNA | D9 | VCC | GND | UREG | VCC | VIN => RAW | GND | + | D8 | D9 | 1 | VIN | + | - | VCC | Spare | TRX | Trv | BIAS | PA | LNA | GND | VDD-Select | VCC / VIN | -
tValues: Gehäuse: beliebig mit Einschub für 100mm Platinen